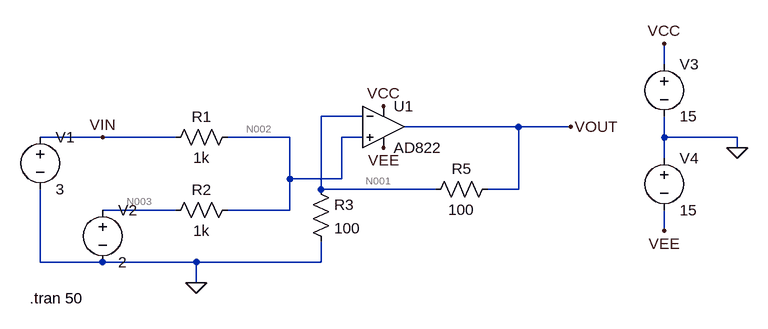
[diagram p0: schematic Summing_Amplifier.asc]
Summing_Amplifier.asc, the LTspice schematic file:
Version 4
SHEET 1 880 680
WIRE 704 96 704 64
WIRE 240 176 176 176
WIRE 480 192 304 192
WIRE 560 192 480 192
WIRE -160 208 -256 208
WIRE -48 208 -160 208
WIRE 128 208 32 208
WIRE 240 208 208 208
WIRE 704 208 704 176
WIRE 816 208 704 208
WIRE 816 224 816 208
WIRE 704 240 704 208
WIRE 128 272 128 208
WIRE 208 272 208 208
WIRE 208 272 128 272
WIRE 176 288 176 176
WIRE 352 288 176 288
WIRE 480 288 480 192
WIRE 480 288 432 288
WIRE -48 320 -160 320
WIRE 128 320 128 272
WIRE 128 320 32 320
WIRE 704 352 704 320
WIRE -256 400 -256 288
WIRE -160 400 -256 400
WIRE -16 400 -160 400
WIRE 176 400 176 368
WIRE 176 400 -16 400
WIRE -16 432 -16 400
FLAG -16 432 0
FLAG 272 160 VCC
FLAG 272 224 VEE
FLAG 816 224 0
FLAG 704 64 VCC
FLAG 704 352 VEE
FLAG -160 208 VIN
FLAG 560 192 VOUT
DATAFLAG -96 208 ""
DATAFLAG -128 208 ""
DATAFLAG -192 208 ""
DATAFLAG -112 320 ""
DATAFLAG -96 320 ""
DATAFLAG -80 320 ""
SYMBOL AD822 272 128 R0
SYMATTR InstName U1
SYMBOL res 48 192 R90
WINDOW 0 0 56 VBottom 2
WINDOW 3 32 56 VTop 2
SYMATTR InstName R1
SYMATTR Value 1k
SYMBOL res 48 304 R90
WINDOW 0 0 56 VBottom 2
WINDOW 3 32 56 VTop 2
SYMATTR InstName R2
SYMATTR Value 1k
SYMBOL voltage -256 192 R0
SYMATTR InstName V1
SYMATTR Value 3
SYMBOL voltage -160 304 R0
SYMATTR InstName V2
SYMATTR Value 2
SYMBOL voltage 704 80 R0
SYMATTR InstName V3
SYMATTR Value 15
SYMBOL voltage 704 224 R0
WINDOW 123 0 0 Left 0
WINDOW 39 0 0 Left 0
SYMATTR InstName V4
SYMATTR Value 15
SYMBOL res 448 272 R90
WINDOW 0 0 56 VBottom 2
WINDOW 3 32 56 VTop 2
SYMATTR InstName R5
SYMATTR Value 100
SYMBOL res 160 272 R0
SYMATTR InstName R3
SYMATTR Value 100
TEXT -272 456 Left 2 !.tran 50

The netlist it stands for:
* Summing_Amplifier.asc
* U1: AD822 (symbol AD822 not available, pins judged from their places): In+=N002 In-=N001 V+=VCC V-=VEE OUT=VOUT
R1 N002 VIN 1k
R2 N002 N003 1k
V1 VIN 0 3
V2 N003 0 2
V3 VCC 0 15
V4 0 VEE 15
R5 VOUT N001 100
R3 N001 0 100
.tran 50
.backanno
.end

* Results of the author's LTspice run, read from the files saved beside the schematic
* Operating Point, zero values left out:
*   V(vcc) = 15 V
*   V(vee) = -15 V
*   V(n001) = 2.5 V
*   V(n002) = 2.5 V
*   V(vout) = 5 V
*   V(vin) = 3 V
*   V(n003) = 2 V
*   I(R3) = 25 mA
*   I(R5) = 25 mA
*   I(R2) = 500 µA
*   I(R1) = -500 µA
*   I(V4) = -710.3 µA
*   I(V3) = -25.71 mA
*   I(V2) = 500 µA
*   I(V1) = -500 µA
*   Ix(u1:1) = 2.125 pA
*   Ix(u1:2) = 2.125 pA
*   Ix(u1:3) = 25.71 mA
*   Ix(u1:4) = -710.3 µA
*   Ix(u1:5) = -25 mA